# Altium project 2225B_VumetreFrequenciel.PrjPcb
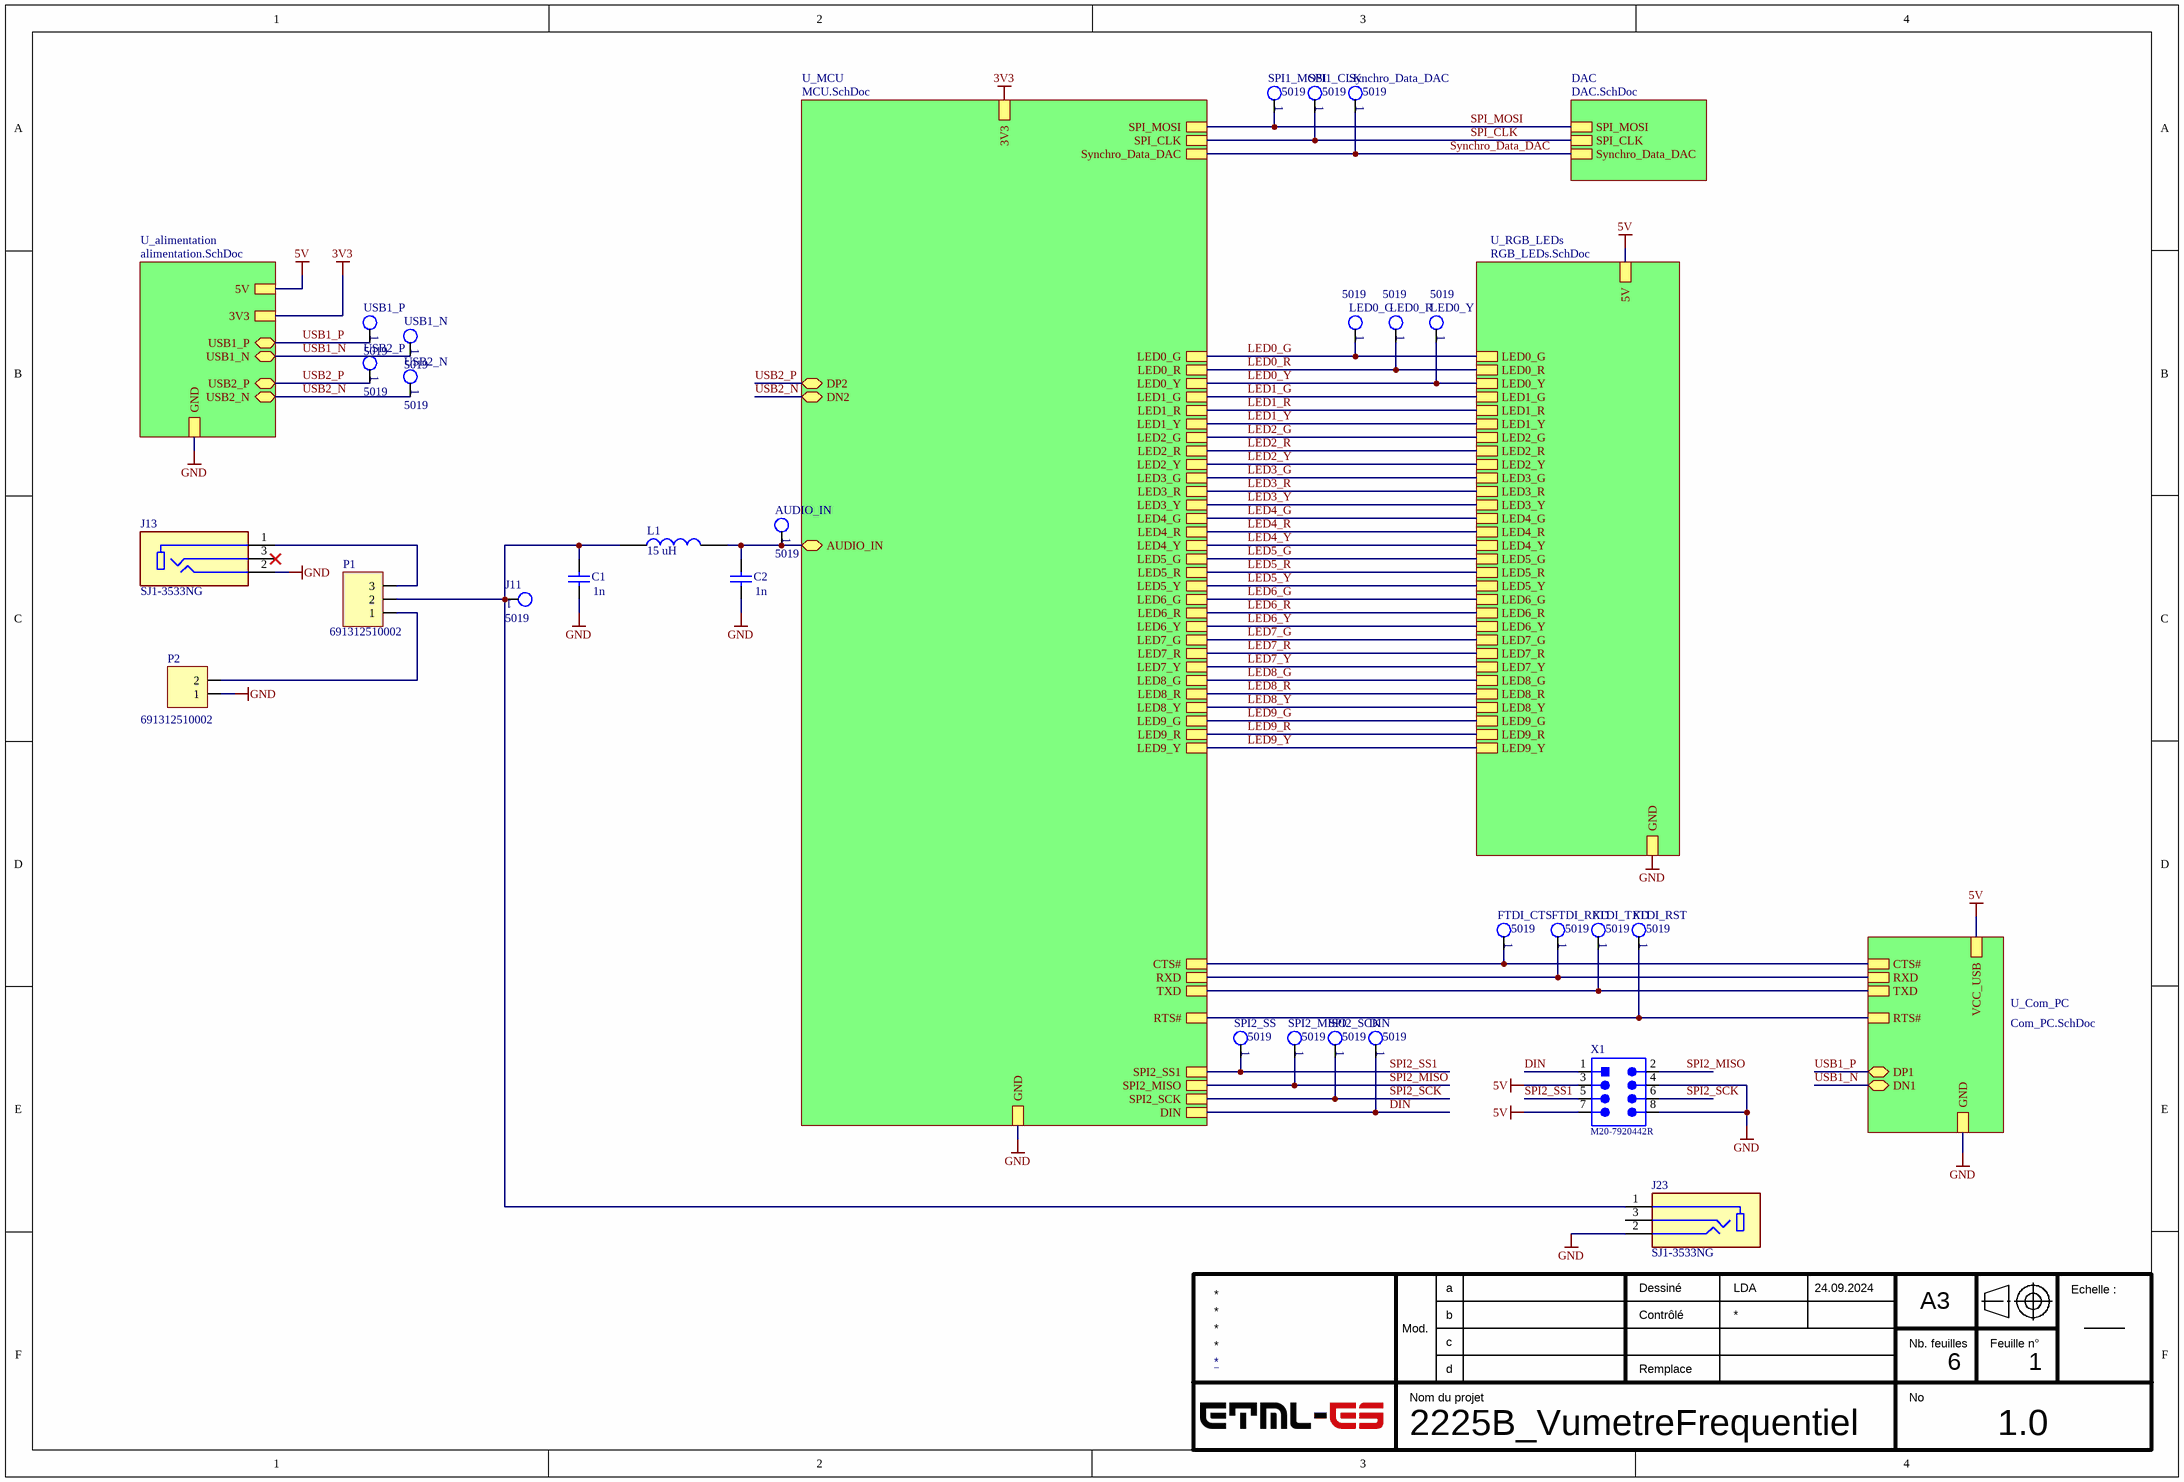
[diagram p0: 2225B_VumetreFrequenciel.SchDoc]
6 sheets, 145 parts. Net scope: hierarchical (ports join the sheet entries above them; power ports are global).
Board file: 2225B_VumetreFrequence_LDA.PcbDoc
Sheets:
  2225B_VumetreFrequenciel.SchDoc
    U_alimentation = alimentation.SchDoc
    U_Com_PC = Com_PC.SchDoc
    U_MCU = MCU.SchDoc
    U_RGB_LEDs = RGB_LEDs.SchDoc
    DAC = DAC.SchDoc

## Sheet 2225B_VumetreFrequenciel.SchDoc: 2225B_VumetreFrequentiel
size 408 x 276 mm; Date: 24.09.2024; DrawnBy: LDA; DocumentNumber: 1.0; SheetNumber: 1; SheetTotal: 6

### Parts
AUDIO_IN  5019  [KEYSTONE_5019]
C1  1n  [C0805]
C2  1n  [C0805]
DIN  5019  [KEYSTONE_5019]
FTDI_CTS  5019  [KEYSTONE_5019]
FTDI_RST  5019  [KEYSTONE_5019]
FTDI_RXD  5019  [KEYSTONE_5019]
FTDI_TXD  5019  [KEYSTONE_5019]
J11  5019  [KEYSTONE_5019]
J13  SJ1-3533NG  [CUI_SJ1-3533NG]
J23  SJ1-3533NG  [CUI_SJ1-3533NG]
L1  15 uH  [WE-PD_1210]
LED0_G  5019  [KEYSTONE_5019]
LED0_R  5019  [KEYSTONE_5019]
LED0_Y  5019  [KEYSTONE_5019]
P1  691312510002  [61300311121]
P2  691312510002  [LINX_CONBNC002]
SPI1_CLK  5019  [KEYSTONE_5019]
SPI1_MOSI  5019  [KEYSTONE_5019]
SPI2_MISO  5019  [KEYSTONE_5019]
SPI2_SCK  5019  [KEYSTONE_5019]
SPI2_SS  5019  [KEYSTONE_5019]
Synchro_Data_DAC  5019  [KEYSTONE_5019]
USB1_N  5019  [KEYSTONE_5019]
USB1_P  5019  [KEYSTONE_5019]
USB2_N  5019  [KEYSTONE_5019]
USB2_P  5019  [KEYSTONE_5019]
X1  M20-7920442R  [610108249121]

### Sub-sheets
DAC = DAC.SchDoc: SPI_MOSI, SPI_CLK, Synchro_Data_DAC
U_alimentation = alimentation.SchDoc: 5V, 3V3, GND, USB1_P (bidir), USB2_P (bidir), USB1_N (bidir), USB2_N (bidir)
U_Com_PC = Com_PC.SchDoc: CTS#, RXD, TXD, GND, RTS#, VCC_USB, DP1 (bidir), DN1 (bidir)
U_MCU = MCU.SchDoc: AUDIO_IN (bidir), 3V3, GND, Synchro_Data_DAC, SPI_CLK, SPI_MOSI, CTS#, RXD, TXD, RTS#, DP2 (bidir), DN2 (bidir), DIN, SPI2_SCK, SPI2_MISO, SPI2_SS1, LED0_G, LED0_R, LED0_Y, LED1_G, LED1_R, LED2_G, LED1_Y, LED2_R, LED2_Y, LED3_G, LED3_R, LED3_Y, LED4_G, LED4_R, LED4_Y, LED5_G, LED5_R, LED5_Y, LED6_G, LED6_R, LED6_Y, LED7_G, LED7_R, LED7_Y, LED8_G, LED8_R, LED8_Y, LED9_G, LED9_R, LED9_Y
U_RGB_LEDs = RGB_LEDs.SchDoc: 5V, GND, LED0_G, LED0_R, LED0_Y, LED1_G, LED1_R, LED1_Y, LED2_G, LED2_R, LED2_Y, LED3_G, LED3_R, LED3_Y, LED4_G, LED4_R, LED4_Y, LED5_G, LED5_R, LED5_Y, LED6_G, LED6_R, LED6_Y, LED7_G, LED7_R, LED7_Y, LED8_G, LED8_R, LED8_Y, LED9_G, LED9_R, LED9_Y

### Nets
3V3: sheet U_alimentation/3V3, sheet U_MCU/3V3
5V: X1.3 X1.7 ; sheet U_alimentation/5V, sheet U_Com_PC/VCC_USB, sheet U_RGB_LEDs/5V
GND: C1.2 C2.2 J13.2 J23.2 P2.1 X1.4 X1.8 ; sheet U_alimentation/GND, sheet U_Com_PC/GND, sheet U_MCU/GND, sheet U_RGB_LEDs/GND
DIN: DIN.1 X1.1 ; sheet U_MCU/DIN
LED0_G: LED0_G.1 ; sheet U_MCU/LED0_G, sheet U_RGB_LEDs/LED0_G
LED0_R: LED0_R.1 ; sheet U_MCU/LED0_R, sheet U_RGB_LEDs/LED0_R
LED0_Y: LED0_Y.1 ; sheet U_MCU/LED0_Y, sheet U_RGB_LEDs/LED0_Y
LED1_G: sheet U_MCU/LED1_G, sheet U_RGB_LEDs/LED1_G
LED1_R: sheet U_MCU/LED1_R, sheet U_RGB_LEDs/LED1_R
LED1_Y: sheet U_MCU/LED1_Y, sheet U_RGB_LEDs/LED1_Y
LED2_G: sheet U_MCU/LED2_G, sheet U_RGB_LEDs/LED2_G
LED2_R: sheet U_MCU/LED2_R, sheet U_RGB_LEDs/LED2_R
LED2_Y: sheet U_MCU/LED2_Y, sheet U_RGB_LEDs/LED2_Y
LED3_G: sheet U_MCU/LED3_G, sheet U_RGB_LEDs/LED3_G
LED3_R: sheet U_MCU/LED3_R, sheet U_RGB_LEDs/LED3_R
LED3_Y: sheet U_MCU/LED3_Y, sheet U_RGB_LEDs/LED3_Y
LED4_G: sheet U_MCU/LED4_G, sheet U_RGB_LEDs/LED4_G
LED4_R: sheet U_MCU/LED4_R, sheet U_RGB_LEDs/LED4_R
LED4_Y: sheet U_MCU/LED4_Y, sheet U_RGB_LEDs/LED4_Y
LED5_G: sheet U_MCU/LED5_G, sheet U_RGB_LEDs/LED5_G
LED5_R: sheet U_MCU/LED5_R, sheet U_RGB_LEDs/LED5_R
LED5_Y: sheet U_MCU/LED5_Y, sheet U_RGB_LEDs/LED5_Y
LED6_G: sheet U_MCU/LED6_G, sheet U_RGB_LEDs/LED6_G
LED6_R: sheet U_MCU/LED6_R, sheet U_RGB_LEDs/LED6_R
LED6_Y: sheet U_MCU/LED6_Y, sheet U_RGB_LEDs/LED6_Y
LED7_G: sheet U_MCU/LED7_G, sheet U_RGB_LEDs/LED7_G
LED7_R: sheet U_MCU/LED7_R, sheet U_RGB_LEDs/LED7_R
LED7_Y: sheet U_MCU/LED7_Y, sheet U_RGB_LEDs/LED7_Y
LED8_G: sheet U_MCU/LED8_G, sheet U_RGB_LEDs/LED8_G
LED8_R: sheet U_MCU/LED8_R, sheet U_RGB_LEDs/LED8_R
LED8_Y: sheet U_MCU/LED8_Y, sheet U_RGB_LEDs/LED8_Y
LED9_G: sheet U_MCU/LED9_G, sheet U_RGB_LEDs/LED9_G
LED9_R: sheet U_MCU/LED9_R, sheet U_RGB_LEDs/LED9_R
LED9_Y: sheet U_MCU/LED9_Y, sheet U_RGB_LEDs/LED9_Y
SPI2_MISO: SPI2_MISO.1 X1.2 ; sheet U_MCU/SPI2_MISO
SPI2_SCK: SPI2_SCK.1 X1.6 ; sheet U_MCU/SPI2_SCK
SPI2_SS1: SPI2_SS.1 X1.5 ; sheet U_MCU/SPI2_SS1
SPI_CLK: SPI1_CLK.1 ; sheet U_MCU/SPI_CLK, sheet DAC/SPI_CLK
SPI_MOSI: SPI1_MOSI.1 ; sheet U_MCU/SPI_MOSI, sheet DAC/SPI_MOSI
Synchro_Data_DAC: Synchro_Data_DAC.1 ; sheet U_MCU/Synchro_Data_DAC, sheet DAC/Synchro_Data_DAC
USB1_N: USB1_N.1 ; sheet U_alimentation/USB1_N, sheet U_Com_PC/DN1
USB1_P: USB1_P.1 ; sheet U_alimentation/USB1_P, sheet U_Com_PC/DP1
USB2_N: USB2_N.1 ; sheet U_alimentation/USB2_N, sheet U_MCU/DN2
USB2_P: USB2_P.1 ; sheet U_alimentation/USB2_P, sheet U_MCU/DP2
NetAUDIO_IN_1: AUDIO_IN.1 C2.1 L1.2 ; sheet U_MCU/AUDIO_IN
NetB1_1: FTDI_RXD.1 ; sheet U_Com_PC/RXD, sheet U_MCU/RXD
NetB1_3: FTDI_CTS.1 ; sheet U_Com_PC/CTS#, sheet U_MCU/CTS#
NetB1_5: FTDI_TXD.1 ; sheet U_Com_PC/TXD, sheet U_MCU/TXD
NetB1_11: FTDI_RST.1 ; sheet U_Com_PC/RTS#, sheet U_MCU/RTS#
NetC1_1: C1.1 J11.1 J23.1 L1.1 P1.2
NetJ13_1: J13.1 P1.3
NetP1_1: P1.1 P2.2

Not connected (* = marked no-connect by the designer): J13 3*; J23 3

### Notes on the sheet
- a
- Dessiné
- A3
- Echelle :
- Mod.
- b
- c
- d
- Contrôlé
- Remplace
- Nb. feuilles
- Feuille n°
- Nom du projet
- No

### Library data of the parts
AUDIO_IN DIN FTDI_CTS FTDI_RST FTDI_RXD FTDI_TXD J11 SPI1_CLK SPI1_MOSI SPI2_MISO SPI2_SCK SPI2_SS Synchro_Data_DAC USB1_N USB1_P USB2_N USB2_P = CMP-1672-00008-2: NexarPartId: 22052288; Manufacturer: Keystone Electronics; Number of Contacts: 1; Contact Material: Bronze, Silver; Number of Pins: 1; Lead Free: Lead Free; Packaging: Tape and Reel; Mount: Surface Mount; Height: 2.286mm; Contact Plating: Silver; Material: Bronze; Termination: SMD/SMT; REACH SVHC: No SVHC; RoHS: Compliant; Manufacturer Part Number: 5019
C1 C2 = Cap: Capacitor; Published: 8-Jun-2000; LatestRevisionDate: 17-Jul-2002; LatestRevisionNote: Re-released for DXP Platform.; PackageReference: RAD-0.3; Publisher: Altium Limited; PackageDescription: Radial Cap, Thru-Hole; 2 Leads; 0.3 in Pin Spacing; Value: 1n
J13 J23 = SJ1-3533NG: 3.5 mm Right-Angle Stereo Jack, 3 Pin PCB Mount, Isolated Ground; MF: {'manufacturer': u'CUI'}; Price: None; Availability: Unavailable; Package: None; MP: SJ1-3533NG; Value: *
L1 = CDRH125NP-220MC: Fixed Inductors 22uH 2.80A 0.028ohms; Manufacturer_Name: Sumida; Geometry.Height: 6mm; Future Part Number: *; Future Price/Stock: *; Manufacturer_Part_Number: CDRH125NP-220MC; Datasheet Link: http://products.sumida.com/products/pdf/CDRH125,CDRH125LD.pdf
LED0_G LED0_R LED0_Y = CMP-1672-00008-2: NexarPartId: 22052288; Manufacturer: Keystone Electronics; Number of Contacts: 1; Material: Bronze; Contact Material: Bronze, Silver; Number of Pins: 1; Lead Free: Lead Free; Packaging: Tape and Reel; Mount: Surface Mount; Height: 2.286mm; Contact Plating: Silver; Termination: SMD/SMT; REACH SVHC: No SVHC; RoHS: Compliant; Manufacturer Part Number: 5019
P1 = MHDR1X3: Header, 3-Pin; LatestRevisionDate: 17-Jul-2002; LatestRevisionNote: Re-released for DXP Platform.; Publisher: Altium Limited
P2 = MHDR1X2: Header, 2-Pin; LatestRevisionDate: 17-Jul-2002; LatestRevisionNote: Re-released for DXP Platform.; Publisher: Altium Limited
X1 = 610108249121: WR-PHD Pin Header, THT, pitch 2.54mm, Dual Row, Angled, 8p; Manufacturer Part Number: 61300821021; Manufacturer: Wurth Elektronik; Pin Number: 8; Rated Current: 3A; Working Voltage: 250VAC; Withstanding Voltage: 500VAC; Contact Resistance: 20mOhm; ComponentLink1Description: Manufacturer; ComponentLink1URL: http://www.we-online.de; ComponentLink2Description: Datasheet; ComponentLink2URL: https://www.we-online.com/catalog/datasheet/61300821021.pdf; Pitch: 2.54mm; Operating Temperature: -40 to +105degC; Mounting Technology: THT; Packaging: Bag; Gender: Pin Header; Row Number: Dual; Orientation: Angled

## Sheet alimentation.SchDoc: 2225B_VumetreFrequentiel
size 276 x 198 mm; Date: 24.09.2024; DrawnBy: LDA; DocumentNumber: 1.0; SheetNumber: 2; SheetTotal: 6
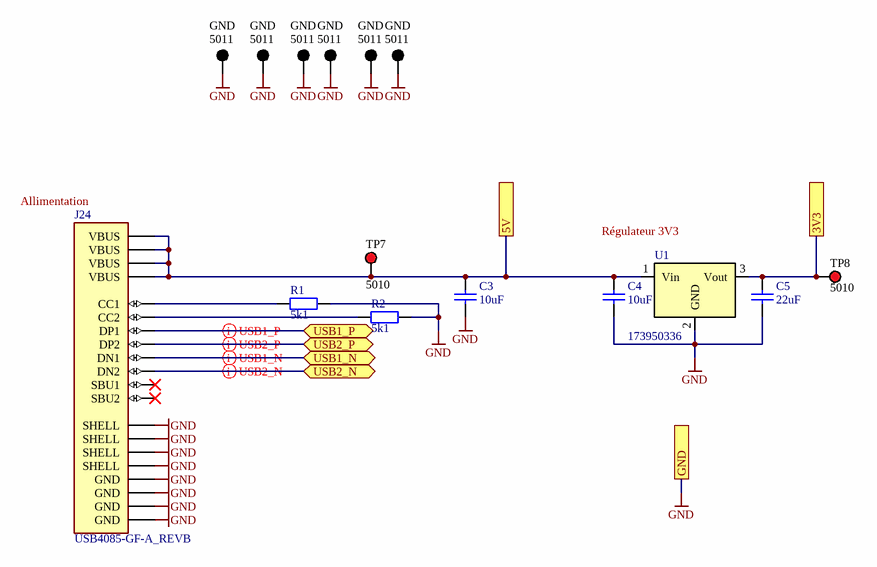
[diagram p1: alimentation.SchDoc]

### Parts
(Parts that share a designator on the sheet are numbered #1, #2 ... from top to bottom, then left to right.)
C3  10uF  [C0805]
C4  10uF  [C0805]
C5  22uF  [C0805]
GND#1  5011  [KSTN-5011_V]
GND#2  5011  [KSTN-5011_V]
GND#3  5011  [KSTN-5011_V]
GND#4  5011  [KSTN-5011_V]
GND#5  5011  [KSTN-5011_V]
GND#6  5011  [KSTN-5011_V]
J24  USB4085-GF-A_REVB  [GCT_USB4085-GF-A_REVB]
R1  5k1  [RESC2012X06M]
R2  5k1  [RESC2012X06M]
TP7  5010  [KSTN-5010_V]
TP8  5010  [KSTN-5010_V]
U1  173950336  [WPME-FDSM_SIP-3_L11.6W8H10.4]

### Ports
3V3, 5V, GND, USB1_N (bidir), USB1_P (bidir), USB2_N (bidir), USB2_P (bidir)

### Nets
3V3: C5.2 TP8.1 U1.3(Vout) ; port 3V3
5V: C3.2 C4.2 J24.A4(VBUS) J24.A9(VBUS) J24.B4(VBUS) J24.B9(VBUS) TP7.1 U1.1(Vin) ; port 5V
GND: C3.1 C4.1 C5.1 GND#1.1 GND#2.1 GND#3.1 GND#4.1 GND#5.1 GND#6.1 J24.A1(GND) J24.A12(GND) J24.B1(GND) J24.B12(GND) J24.S1(SHELL) J24.S2(SHELL) J24.S3(SHELL) J24.S4(SHELL) R1.1 R2.1 U1.2(GND) ; port GND
USB1_N: J24.A7(DN1) ; port USB1_N
USB1_P: J24.A6(DP1) ; port USB1_P
USB2_N: J24.B7(DN2) ; port USB2_N
USB2_P: J24.B6(DP2) ; port USB2_P
NetJ24_A5: J24.A5(CC1) R1.2
NetJ24_B5: J24.B5(CC2) R2.2

Not connected (* = marked no-connect by the designer): J24 A8(SBU1)* B8(SBU2)*

### Layout directives
differential pair: USB1_N, USB1_P, USB2_N, USB2_P

### Notes on the sheet
- (near J24) Allimentation
- Régulateur 3V3
- a
- Dessiné
- A4
- Echelle :
- Mod.
- b
- c
- d
- Contrôlé
- Remplace
- Nb. feuilles
- Feuille n°
- Nom du projet
- No

### Library data of the parts
C3-C5 = Cap: Capacitor; Published: 8-Jun-2000; LatestRevisionDate: 17-Jul-2002; LatestRevisionNote: Re-released for DXP Platform.; PackageReference: RAD-0.3; Publisher: Altium Limited; PackageDescription: Radial Cap, Thru-Hole; 2 Leads; 0.3 in Pin Spacing
  C3 C4: Value: 10uF
  C5: Value: 22uF
GND#1-GND#6 = CMP-1672-00003-4: Test Point, Black, Through Hole, RoHS, Bulk; Manufacturer: Keystone; ComponentLink2URL: http://www.keyelco.com/product-pdf.cfm?p=1320; Colour: Black; Pins: 1; REACH SVHC: No SVHC; ComponentLink1URL: http://www.keyelco.com/; PackageReference: 5011; Contact Plating: Silver; Package Quantity: 100; Packaging: Bulk; RoHSCompliant: true; Height: 8.12 mm; PackageDescription: 1-Pin Through Hole Device, Dia 3.17 mm; Mount: Through Hole; Mounting Technology: Through Hole; DatasheetVersion: Rev. F, 12/2013; ComponentLink1Description: Manufacturer URL; Contact Material: Bronze; ComponentLink2Description: Datasheet
J24 = USB4085-GF-A_REVB: USB-C (USB TYPE-C) USB 2.0 æ’åº§è¿žæŽ¥å™¨ 24 (16+8 Dummy) ä½é€šå­”ã€ç›´è§’ã€ä½Žæˆæœ¬ã€3.46mm å¤–å½¢ã€16 é’ˆã€æ°´å¹³ã€é¡¶éƒ¨å®‰è£…; MF: Global Connector Technology; SnapEDA_Link: https://www.snapeda.com/parts/USB4085-GF-A/Global+Connector+Technology/view-part/?ref=snap; Package: None; Value: *; MP: USB4085-GF-A; Check_prices: https://www.snapeda.com/parts/USB4085-GF-A/Global+Connector+Technology/view-part/?ref=eda
R1 R2 = Res2: Resistor; Published: 8-Jun-2000; LatestRevisionDate: 17-Jul-2002; LatestRevisionNote: Re-released for DXP Platform.; PackageReference: AXIAL-0.4; Publisher: Altium Limited; PackageDescription: Axial Device, Thru-Hole; 2 Leads; 0.4 in Pin Spacing; Value: 5k1
TP7 TP8 = CMP-1672-00002-4: Test Point, Red, Through Hole, RoHS, Bulk; Manufacturer: Keystone; Contact Material: Bronze; Mounting Technology: Through Hole; RoHSCompliant: true; Pins: 1; Package Quantity: 100; ComponentLink2Description: Datasheet; Height: 8.12 mm; ComponentLink1URL: http://www.keyelco.com/; DatasheetVersion: Rev. F, 12/2013; Mount: Through Hole; PackageReference: 5010; Contact Plating: Silver; Packaging: Bulk; Colour: Red; REACH SVHC: No SVHC; PackageDescription: 1-Pin Through Hole Device, Dia 3.17 mm; ComponentLink2URL: http://www.keyelco.com/product-pdf.cfm?p=1319; ComponentLink1Description: Manufacturer URL
U1 = 173950536

## Sheet Com_PC.SchDoc: 2225B_VumetreFrequentiel
size 276 x 198 mm; Date: 24.09.2024; DrawnBy: LDA; DocumentNumber: 1.0; SheetNumber: 3; SheetTotal: 6
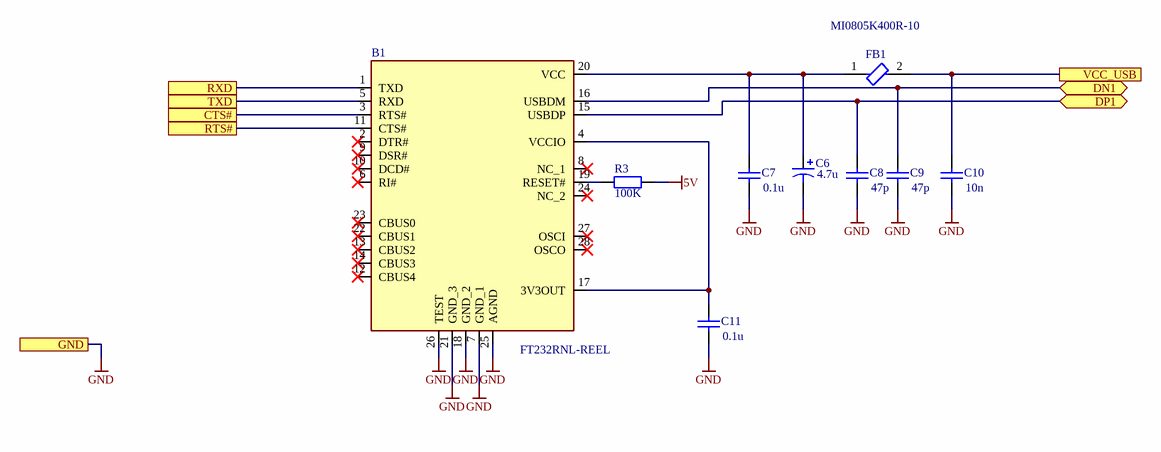
[diagram p2: Com_PC.SchDoc]

### Parts
B1  FT232RNL-REEL  [SOP65P780X200-28N]
C6  4.7u  [PCAP_SVP_A5_PAN-M]
C7  0.1u  [C0805]
C8  47p  [C0805]
C9  47p  [C0805]
C10  10n  [C0805]
C11  0.1u  [C0805]
FB1  MI0805K400R-10  [FP-MI0805-MFG]
R3  100K  [RESC2012X06M]

### Ports
CTS#, DN1 (bidir), DP1 (bidir), GND, RTS#, RXD, TXD, VCC_USB

### Nets
5V: C10.1 FB1.2 R3.1 ; port VCC_USB
GND: B1.7(GND_1) B1.18(GND_2) B1.21(GND_3) B1.25(AGND) B1.26(TEST) C6.2 C7.2 C8.2 C9.2 C10.2 C11.2 ; port GND
USB1_N: B1.16(USBDM) C9.1 ; port DN1
USB1_P: B1.15(USBDP) C8.1 ; port DP1
NetB1_1: B1.1(TXD) ; port RXD
NetB1_3: B1.3(RTS#) ; port CTS#
NetB1_4: B1.4(VCCIO) B1.17(3V3OUT) C11.1
NetB1_5: B1.5(RXD) ; port TXD
NetB1_11: B1.11(CTS#) ; port RTS#
NetB1_19: B1.19(RESET#) R3.2
NetB1_20: B1.20(VCC) C6.1 C7.1 FB1.1

Not connected (* = marked no-connect by the designer): B1 2(DTR#)* 6(RI#)* 8(NC_1)* 9(DSR#)* 10(DCD#)* 12(CBUS4)* 13(CBUS2)* 14(CBUS3)* 22(CBUS1)* 23(CBUS0)* 24(NC_2)* 27(OSCI)* 28(OSCO)*

### Notes on the sheet
- a
- Dessiné
- A4
- Echelle :
- Mod.
- b
- c
- d
- Contrôlé
- Remplace
- Nb. feuilles
- Feuille n°
- Nom du projet
- No

### Library data of the parts
B1 = FT232RNL-REEL: UART Interface IC USB Full Speed to Serial UART IC, Includes Oscillator and EEPROM, SSOP-28; Manufacturer_Name: FTDI Chip; Geometry.Height: 2mm; Manufacturer_Part_Number: FT232RNL-REEL; Mouser Part Number: 895-FT232RNL-REEL; Mouser Price/Stock: https://www.mouser.co.uk/ProductDetail/FTDI/FT232RNL-REEL?qs=By6Nw2ByBD3LSfXryh9qRQ%3D%3D; Arrow Part Number: FT232RNL-REEL; Arrow Price/Stock: https://www.arrow.com/en/products/ft232rnl-reel/ftdi-chip?utm_currency=USD&region=europe; Datasheet Link: https://ftdichip.com/wp-content/uploads/2022/12/DS_FT232RN.pdf
C6 = Cap Pol1: Polarized Capacitor (Radial); Published: 8-Jun-2000; LatestRevisionDate: 17-Jul-2002; LatestRevisionNote: Re-released for DXP Platform.; PackageReference: RB7.6-15; Publisher: Altium Limited; PackageDescription: Polarized Capacitor (Radial); 2 Leads; Value: 4.7u
C7-C11 = Cap: Capacitor; Published: 8-Jun-2000; LatestRevisionDate: 17-Jul-2002; LatestRevisionNote: Re-released for DXP Platform.; PackageReference: RAD-0.3; Publisher: Altium Limited; PackageDescription: Radial Cap, Thru-Hole; 2 Leads; 0.3 in Pin Spacing
  C7 C11: Value: 0.1u
  C8 C9: Value: 47p
  C10: Value: 10n
FB1 = CMP-2000-06702-2: FERRITE BEAD 40 OHM 0805 1LN; Impedance: 40R; Max Current Rating: 1.5A; Tolerance: 25%; Test Frequency: 100MHz; DC Resistance (DCR): 50mR; Number of Lines: 1; Min Operating Temperature: -40°C; Case/Package: 0805; Depth: 1.45mm; Current Rating: 1.5A; Width: 0.049inch; Core Material: Ferrite; Termination: SMD/SMT; Case Code (Imperial): 0805; Packaging: Tape and Reel; Weight: 0.00392oz; Lead Free: Lead Free; Length: 2mm; Max Operating Temperature: 125°C; Mount: Surface Mount; Case Code (Metric): 2012; Frequency: 100MHz; Height: 0.043inch; Package Quantity: 1; Material: Ferrite; Contact Plating: Tin; Max DC Current: 1.5A
R3 = Res2: Resistor; Published: 8-Jun-2000; LatestRevisionDate: 17-Jul-2002; LatestRevisionNote: Re-released for DXP Platform.; PackageReference: AXIAL-0.4; Publisher: Altium Limited; PackageDescription: Axial Device, Thru-Hole; 2 Leads; 0.4 in Pin Spacing; Value: 100K

## Sheet MCU.SchDoc: 2225B_VumetreFrequentiel
size 408 x 276 mm; Date: 24.09.2024; DrawnBy: LDA; DocumentNumber: 1.0; Revision: 1.0; SheetNumber: 5; SheetTotal: 6
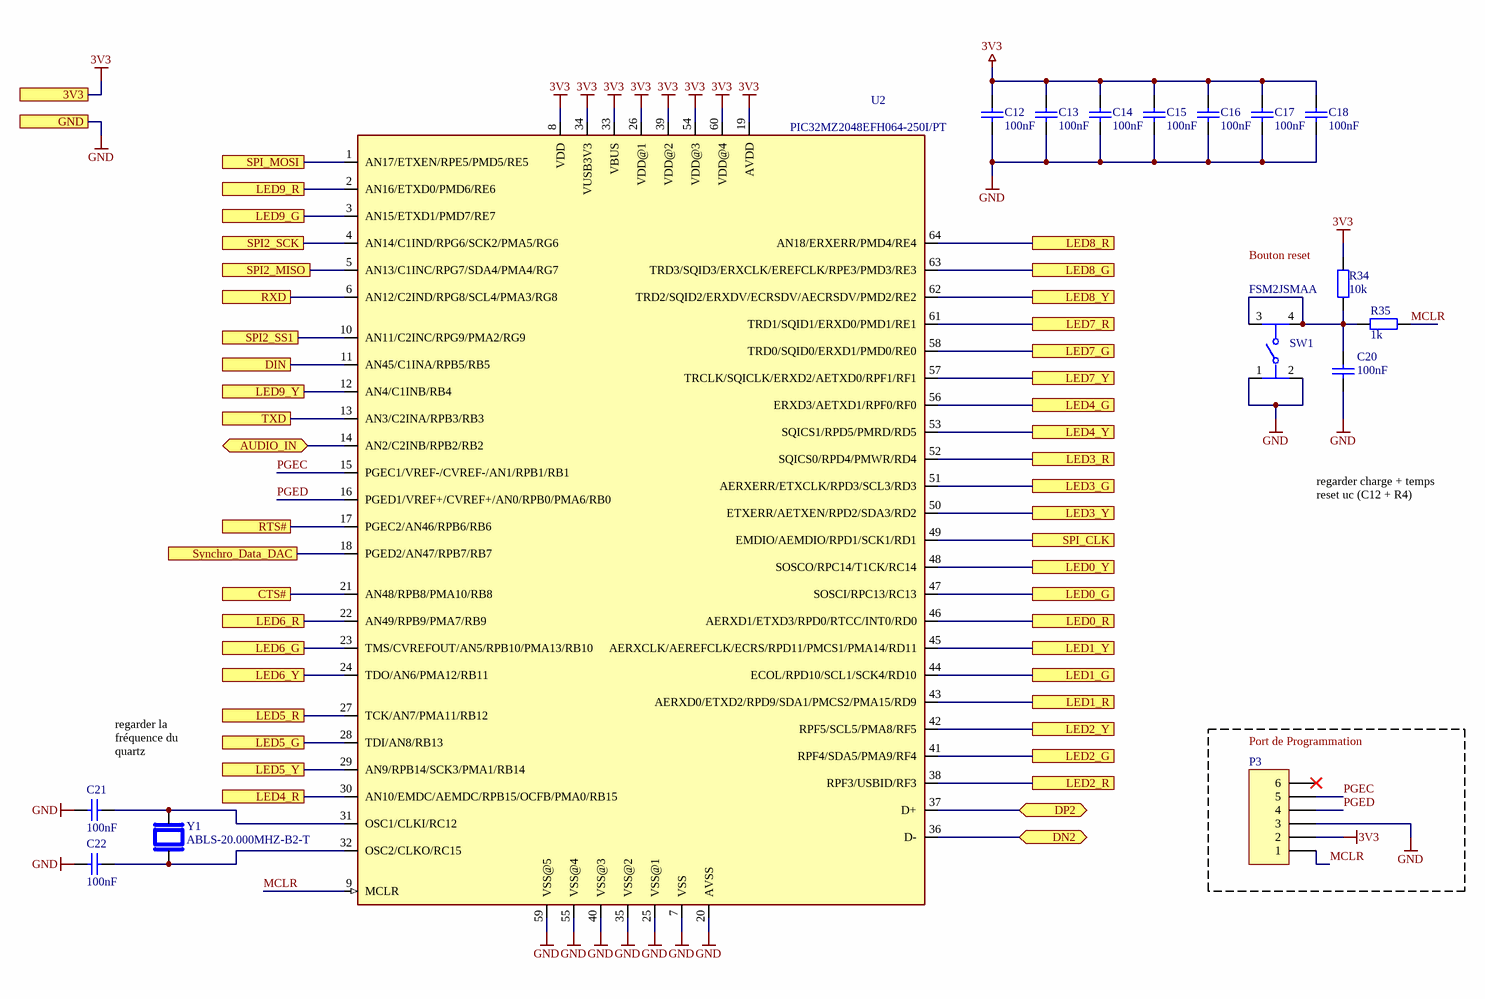
[diagram p3: MCU.SchDoc]

### Parts
C12  100nF  [C0805]
C13  100nF  [C0805]
C14  100nF  [C0805]
C15  100nF  [C0805]
C16  100nF  [C0805]
C17  100nF  [C0805]
C18  100nF  [C0805]
C20  100nF  [C0805]
C21  100nF  [C0805]
C22  100nF  [C0805]
P3  76384-406LF  [HDR1X6]  (value not drawn)
R34  10k  [RESC2012X06M]
R35  1k  [RESC2012X06M]
SW1  FSM2JSMAA  [FP-FSM2JSMAA-MFG]
U2  PIC32MZ2048EFH064-250I/PT  [QFP50P1200X1200X120-64N]
Y1  ABLS-20.000MHZ-B2-T  [XTAL_ABLS-20.000MHZ-B2-T]

### Blocks framed on the sheet
Port de Programmation: P3

### Ports
3V3, AUDIO_IN (bidir), CTS#, DIN, DN2 (bidir), DP2 (bidir), GND, LED0_G, LED0_R, LED0_Y, LED1_G, LED1_R, LED1_Y, LED2_G, LED2_R, LED2_Y, LED3_G, LED3_R, LED3_Y, LED4_G, LED4_R, LED4_Y, LED5_G, LED5_R, LED5_Y, LED6_G, LED6_R, LED6_Y, LED7_G, LED7_R, LED7_Y, LED8_G, LED8_R, LED8_Y, LED9_G, LED9_R, LED9_Y, RTS#, RXD, SPI2_MISO, SPI2_SCK, SPI2_SS1, SPI_CLK, SPI_MOSI, Synchro_Data_DAC, TXD

### Nets
3V3: C12.1 C13.1 C14.1 C15.1 C16.1 C17.1 C18.1 P3.2 R34.1 U2.8(VDD) U2.19(AVDD) U2.26(VDD@1) U2.33(VBUS) U2.34(VUSB3V3) U2.39(VDD@2) U2.54(VDD@3) U2.60(VDD@4) ; port 3V3
GND: C12.2 C13.2 C14.2 C15.2 C16.2 C17.2 C18.2 C20.1 C21.2 C22.2 P3.3 SW1.1 SW1.2 U2.7(VSS) U2.20(AVSS) U2.25(VSS@1) U2.35(VSS@2) U2.40(VSS@3) U2.55(VSS@4) U2.59(VSS@5) ; port GND
DIN: U2.11(AN45/C1INA/RPB5/RB5) ; port DIN
LED0_G: U2.47(SOSCI/RPC13/RC13) ; port LED0_G
LED0_R: U2.46(AERXD1/ETXD3/RPD0/RTCC/INT0/RD0) ; port LED0_R
LED0_Y: U2.48(SOSCO/RPC14/T1CK/RC14) ; port LED0_Y
LED1_G: U2.44(ECOL/RPD10/SCL1/SCK4/RD10) ; port LED1_G
LED1_R: U2.43(AERXD0/ETXD2/RPD9/SDA1/PMCS2/PMA15/RD9) ; port LED1_R
LED1_Y: U2.45(AERXCLK/AEREFCLK/ECRS/RPD11/PMCS1/PMA14/RD11) ; port LED1_Y
LED2_G: U2.41(RPF4/SDA5/PMA9/RF4) ; port LED2_G
LED2_R: U2.38(RPF3/USBID/RF3) ; port LED2_R
LED2_Y: U2.42(RPF5/SCL5/PMA8/RF5) ; port LED2_Y
LED3_G: U2.51(AERXERR/ETXCLK/RPD3/SCL3/RD3) ; port LED3_G
LED3_R: U2.52(SQICS0/RPD4/PMWR/RD4) ; port LED3_R
LED3_Y: U2.50(ETXERR/AETXEN/RPD2/SDA3/RD2) ; port LED3_Y
LED4_G: U2.56(ERXD3/AETXD1/RPF0/RF0) ; port LED4_G
LED4_R: U2.30(AN10/EMDC/AEMDC/RPB15/OCFB/PMA0/RB15) ; port LED4_R
LED4_Y: U2.53(SQICS1/RPD5/PMRD/RD5) ; port LED4_Y
LED5_G: U2.28(TDI/AN8/RB13) ; port LED5_G
LED5_R: U2.27(TCK/AN7/PMA11/RB12) ; port LED5_R
LED5_Y: U2.29(AN9/RPB14/SCK3/PMA1/RB14) ; port LED5_Y
LED6_G: U2.23(TMS/CVREFOUT/AN5/RPB10/PMA13/RB10) ; port LED6_G
LED6_R: U2.22(AN49/RPB9/PMA7/RB9) ; port LED6_R
LED6_Y: U2.24(TDO/AN6/PMA12/RB11) ; port LED6_Y
LED7_G: U2.58(TRD0/SQID0/ERXD1/PMD0/RE0) ; port LED7_G
LED7_R: U2.61(TRD1/SQID1/ERXD0/PMD1/RE1) ; port LED7_R
LED7_Y: U2.57(TRCLK/SQICLK/ERXD2/AETXD0/RPF1/RF1) ; port LED7_Y
LED8_G: U2.63(TRD3/SQID3/ERXCLK/EREFCLK/RPE3/PMD3/RE3) ; port LED8_G
LED8_R: U2.64(AN18/ERXERR/PMD4/RE4) ; port LED8_R
LED8_Y: U2.62(TRD2/SQID2/ERXDV/ECRSDV/AECRSDV/PMD2/RE2) ; port LED8_Y
LED9_G: U2.3(AN15/ETXD1/PMD7/RE7) ; port LED9_G
LED9_R: U2.2(AN16/ETXD0/PMD6/RE6) ; port LED9_R
LED9_Y: U2.12(AN4/C1INB/RB4) ; port LED9_Y
MCLR: P3.1 R35.1 U2.9(MCLR)
PGEC: P3.5 U2.15(PGEC1/VREF-/CVREF-/AN1/RPB1/RB1)
PGED: P3.4 U2.16(PGED1/VREF+/CVREF+/AN0/RPB0/PMA6/RB0)
SPI2_MISO: U2.5(AN13/C1INC/RPG7/SDA4/PMA4/RG7) ; port SPI2_MISO
SPI2_SCK: U2.4(AN14/C1IND/RPG6/SCK2/PMA5/RG6) ; port SPI2_SCK
SPI2_SS1: U2.10(AN11/C2INC/RPG9/PMA2/RG9) ; port SPI2_SS1
SPI_CLK: U2.49(EMDIO/AEMDIO/RPD1/SCK1/RD1) ; port SPI_CLK
SPI_MOSI: U2.1(AN17/ETXEN/RPE5/PMD5/RE5) ; port SPI_MOSI
Synchro_Data_DAC: U2.18(PGED2/AN47/RPB7/RB7) ; port Synchro_Data_DAC
USB2_N: U2.36(D-) ; port DN2
USB2_P: U2.37(D+) ; port DP2
NetAUDIO_IN_1: U2.14(AN2/C2INB/RPB2/RB2) ; port AUDIO_IN
NetB1_1: U2.6(AN12/C2IND/RPG8/SCL4/PMA3/RG8) ; port RXD
NetB1_3: U2.21(AN48/RPB8/PMA10/RB8) ; port CTS#
NetB1_5: U2.13(AN3/C2INA/RPB3/RB3) ; port TXD
NetB1_11: U2.17(PGEC2/AN46/RPB6/RB6) ; port RTS#
NetC20_2: C20.2 R34.2 R35.2 SW1.3 SW1.4
NetC21_1: C21.1 U2.31(OSC1/CLKI/RC12) Y1.2
NetC22_1: C22.1 U2.32(OSC2/CLKO/RC15) Y1.1

Not connected (* = marked no-connect by the designer): P3 6*

### Notes on the sheet
- (near R34) Bouton reset
- regarder charge + temps reset uc (C12 + R4)
- regarder la fréquence du quartz
- a
- Dessiné
- A3
- Echelle :
- Mod.
- b
- c
- d
- Contrôlé
- Remplace
- Nb. feuilles
- Feuille n°
- Nom du projet
- No

### Library data of the parts
C12-C18 = Cap: Capacitor; Published: 8-Jun-2000; LatestRevisionDate: 17-Jul-2002; LatestRevisionNote: Re-released for DXP Platform.; PackageReference: RAD-0.3; Publisher: Altium Limited; PackageDescription: Radial Cap, Thru-Hole; 2 Leads; 0.3 in Pin Spacing; Value: 100nF
C20-C22 = Cap: 10nf; Published: 8-Jun-2000; LatestRevisionDate: 17-Jul-2002; LatestRevisionNote: Re-released for DXP Platform.; PackageReference: RAD-0.3; Publisher: Altium Limited; PackageDescription: Radial Cap, Thru-Hole; 2 Leads; 0.3 in Pin Spacing; Value: 100nF
P3 = Header 6: Header, 6-Pin; LatestRevisionDate: 17-Jul-2002; LatestRevisionNote: Re-released for DXP Platform.; Publisher: Altium Limited
R34 R35 = Res2: Resistor; Published: 8-Jun-2000; LatestRevisionDate: 17-Jul-2002; LatestRevisionNote: Re-released for DXP Platform.; PackageReference: AXIAL-0.4; Publisher: Altium Limited; PackageDescription: Axial Device, Thru-Hole; 2 Leads; 0.4 in Pin Spacing
  R34: Value: 10k
  R35: Value: 1k
SW1 = CMP-03402-000003-1: SWITCH TACTILE SPST-NO 0.05A 24V; Manufacturer: TE Connectivity; Standoff Height: 0.05mm; Contact Current Rating: 50mA; Electromechanical Life: 100000Cycles; Operating Force: 260gf; Contact Resistance: 100mΩ; Package: 0; Temperature Range High: +85°C; Temperature: -35°C to +85°C; Category: Switch; Manufacturer Part Number: FSM2JSMAA; RoHS: TRUE; Mouser Description: Tactile Switches TACTILE 260G FORCE S; Device Class L1: Electromechanical; Mount: Surface Mount; Height: 4.59mm; ComponentLink2URL: https://www.te.com/commerce/DocumentDelivery/DDEController?Action=showdoc&DocId=Customer+Drawing%7F2-1437565-7%7FV%7Fpdf%7FEnglish%7FENG_CD_2-1437565-7_V.pdf%7F2-1437565-8; Temperature Range Low: -35°C; Voltage Rating Dc: 24V; Lead Free: Yes; Automotive: No; Throw Configuration: SPST-NO; Octopart: https://octopart.com/fsm2jsmaa-te+connectivity-41720620; Device Class L2: Switches; Device Class L3: Pushbutton Switches; ComponentLink2Description: Datasheet; Digikey Description: SWITCH TACTILE SPST-NO 0.05A 24V
U2 = PIC32MZ2048EFH064-250I/PT: MIPS32Â® M-Class PICÂ® 32MZ Microcontroller IC 32-Bit 250MHz 2MB _2M x 8_ FLASH 64-TQFP _10x10_; MF: Microchip; MP: PIC32MZ2048EFH064-250I/PT; SnapEDA_Link: https://www.snapeda.com/parts/PIC32MZ2048EFH064-250I/PT/Microchip/view-part/1145914/?ref=snap; Digi-Key_Purchase_URL: https://www.digikey.com/product-detail/en/microchip-technology/PIC32MZ2048EFH064-250I-PT/PIC32MZ2048EFH064-250I-PT-ND/6152256?utm_source=snapeda&utm_medium=aggregator&utm_campaign=symbol; Value: *; Package: TQFP-64 Microchip; Digi-Key_Part_Number: PIC32MZ2048EFH064-250I/PT-ND
Y1 = ABLS-20.000MHZ-B2-T: HC/49US (AT49) SMD LOW PROFILE CRYSTAL; MF: Abracon LLC; Availability: In Stock; SnapEDA_Link: https://www.snapeda.com/parts/ABLS-20.000MHZ-B2-T/Abracon+LLC/view-part/?ref=snap; Check_prices: https://www.snapeda.com/parts/ABLS-20.000MHZ-B2-T/Abracon+LLC/view-part/?ref=eda; Price: None; Package: HC-49/US Abracon LLC; Purchase-URL: https://pricing.snapeda.com/search/part/ABLS-20.000MHZ-B2-T/?ref=eda; MP: ABLS-20.000MHZ-B2-T; Value: *

## Sheet RGB_LEDs.SchDoc: 2225B_VumetreFrequentiel
size 408 x 276 mm; Date: 24.09.2024; DrawnBy: LDA; DocumentNumber: 1.0; SheetNumber: 4; SheetTotal: 6
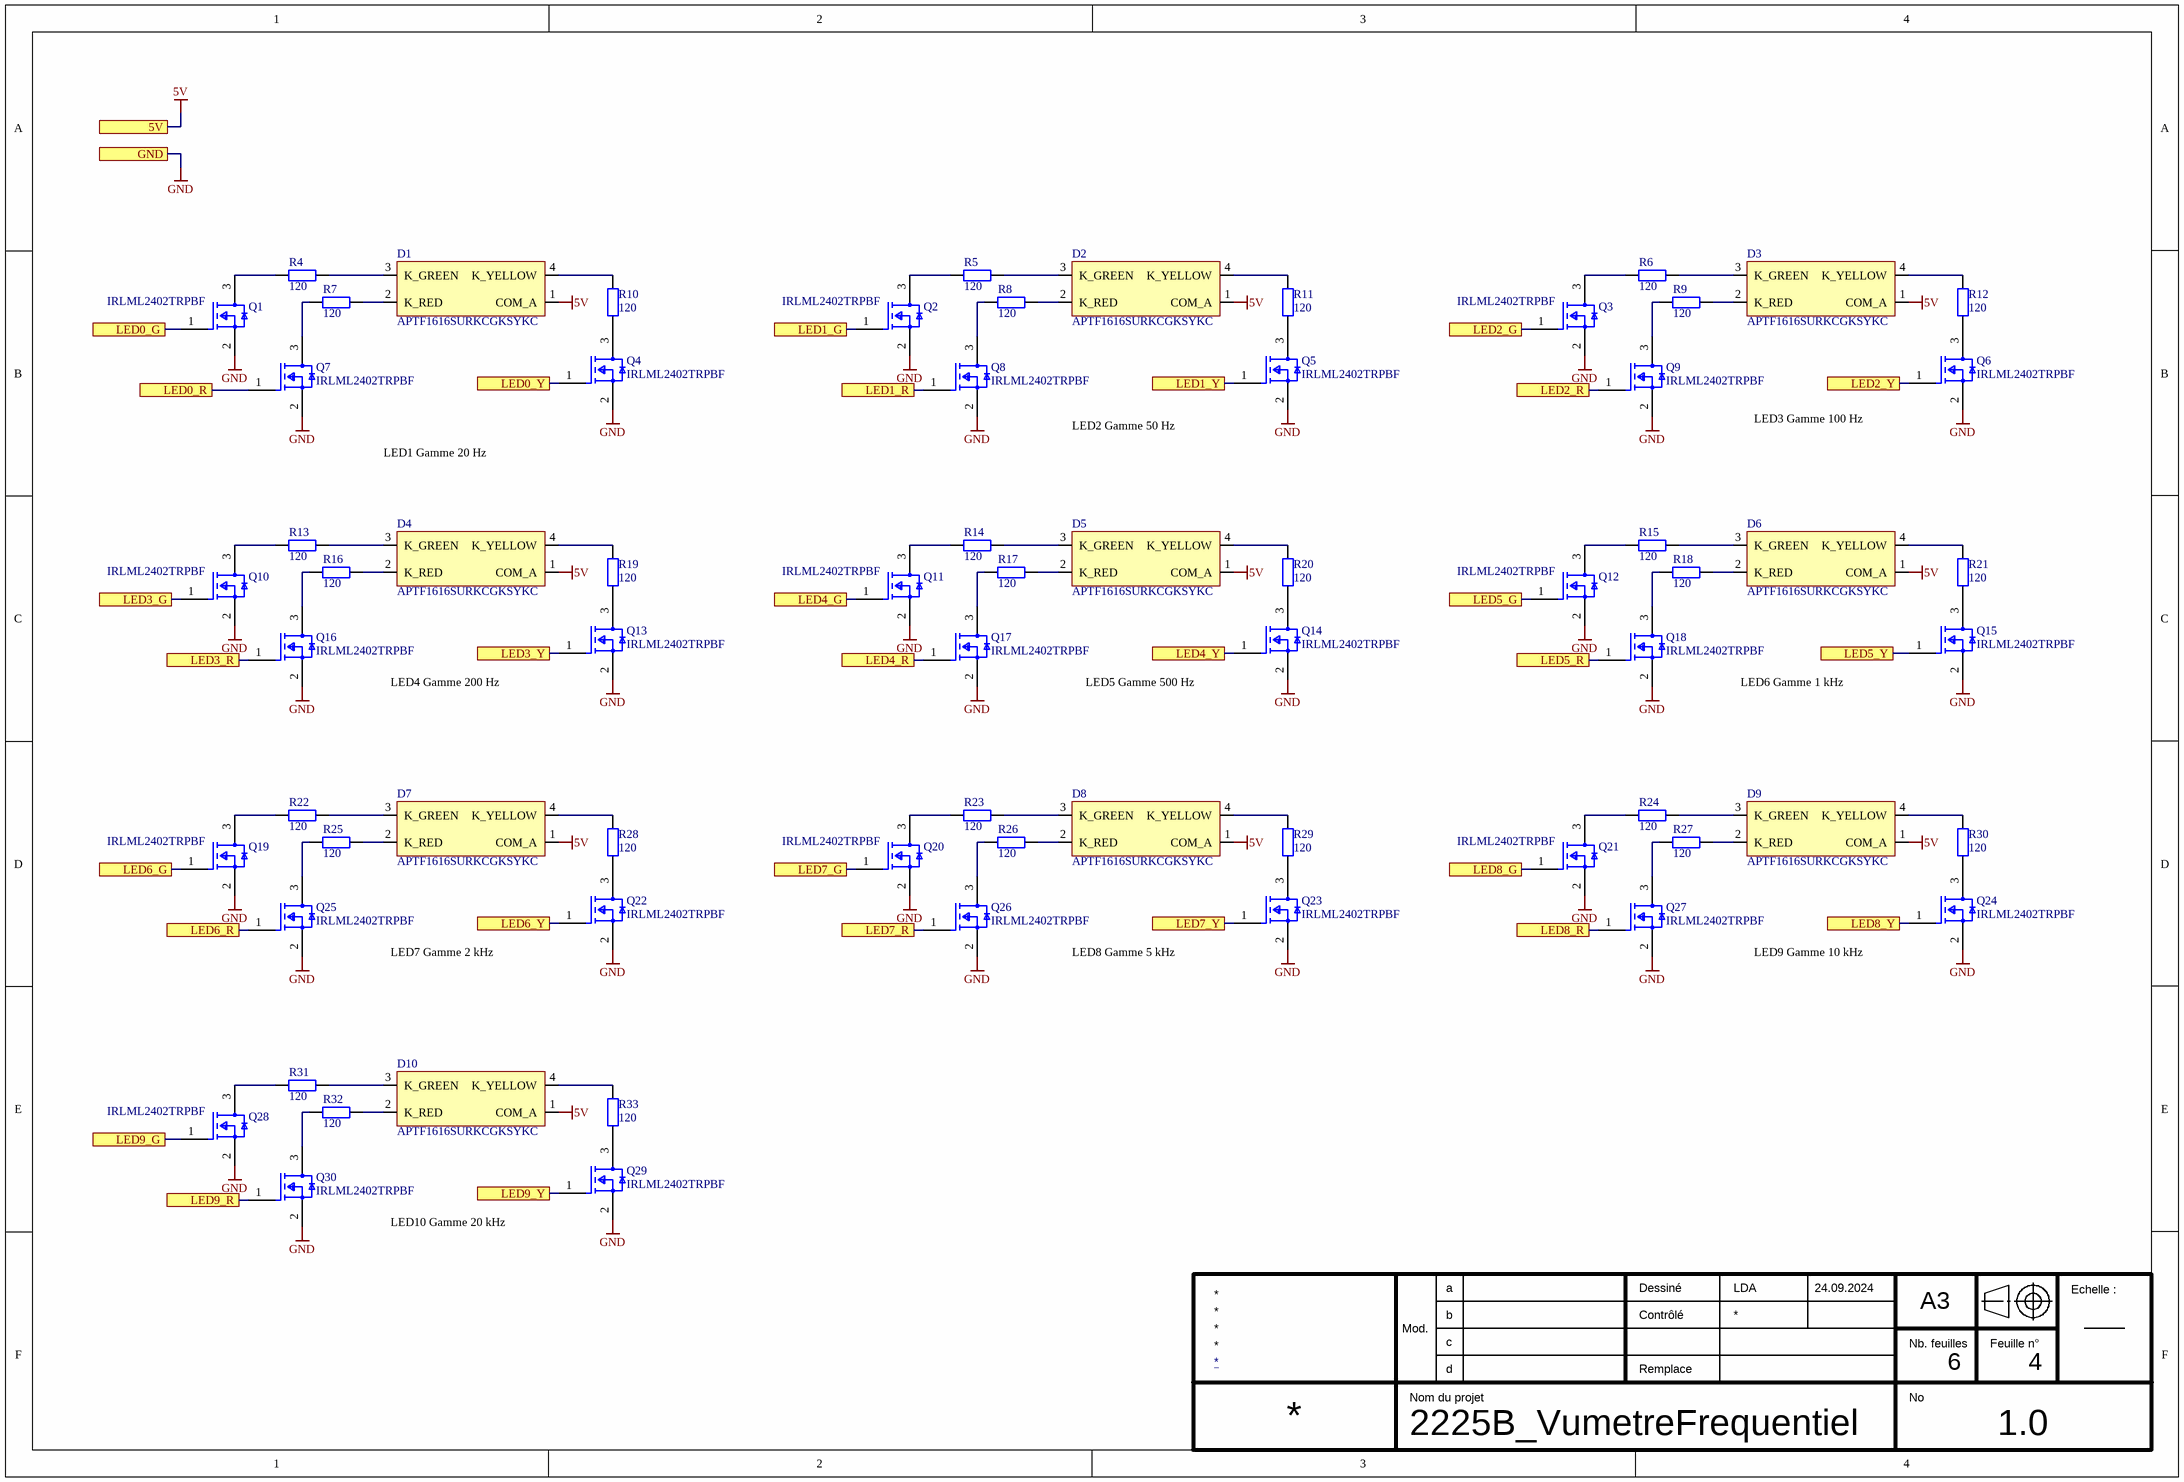
[diagram p4: RGB_LEDs.SchDoc]

### Parts
D1  APTF1616SURKCGKSYKC  [APTF1616SURKCGKSYKC]
D2  APTF1616SURKCGKSYKC  [APTF1616SURKCGKSYKC]
D3  APTF1616SURKCGKSYKC  [APTF1616SURKCGKSYKC]
D4  APTF1616SURKCGKSYKC  [APTF1616SURKCGKSYKC]
D5  APTF1616SURKCGKSYKC  [APTF1616SURKCGKSYKC]
D6  APTF1616SURKCGKSYKC  [APTF1616SURKCGKSYKC]
D7  APTF1616SURKCGKSYKC  [APTF1616SURKCGKSYKC]
D8  APTF1616SURKCGKSYKC  [APTF1616SURKCGKSYKC]
D9  APTF1616SURKCGKSYKC  [APTF1616SURKCGKSYKC]
D10  APTF1616SURKCGKSYKC  [APTF1616SURKCGKSYKC]
Q1  IRLML2402TRPBF  [FP-Micro3-IPC_B]
Q2  IRLML2402TRPBF  [FP-Micro3-IPC_B]
Q3  IRLML2402TRPBF  [FP-Micro3-IPC_B]
Q4  IRLML2402TRPBF  [FP-Micro3-IPC_B]
Q5  IRLML2402TRPBF  [FP-Micro3-IPC_B]
Q6  IRLML2402TRPBF  [FP-Micro3-IPC_B]
Q7  IRLML2402TRPBF  [FP-Micro3-IPC_B]
Q8  IRLML2402TRPBF  [FP-Micro3-IPC_B]
Q9  IRLML2402TRPBF  [FP-Micro3-IPC_B]
Q10  IRLML2402TRPBF  [FP-Micro3-IPC_B]
Q11  IRLML2402TRPBF  [FP-Micro3-IPC_B]
Q12  IRLML2402TRPBF  [FP-Micro3-IPC_B]
Q13  IRLML2402TRPBF  [FP-Micro3-IPC_B]
Q14  IRLML2402TRPBF  [FP-Micro3-IPC_B]
Q15  IRLML2402TRPBF  [FP-Micro3-IPC_B]
Q16  IRLML2402TRPBF  [FP-Micro3-IPC_B]
Q17  IRLML2402TRPBF  [FP-Micro3-IPC_B]
Q18  IRLML2402TRPBF  [FP-Micro3-IPC_B]
Q19  IRLML2402TRPBF  [FP-Micro3-IPC_B]
Q20  IRLML2402TRPBF  [FP-Micro3-IPC_B]
Q21  IRLML2402TRPBF  [FP-Micro3-IPC_B]
Q22  IRLML2402TRPBF  [FP-Micro3-IPC_B]
Q23  IRLML2402TRPBF  [FP-Micro3-IPC_B]
Q24  IRLML2402TRPBF  [FP-Micro3-IPC_B]
Q25  IRLML2402TRPBF  [FP-Micro3-IPC_B]
Q26  IRLML2402TRPBF  [FP-Micro3-IPC_B]
Q27  IRLML2402TRPBF  [FP-Micro3-IPC_B]
Q28  IRLML2402TRPBF  [FP-Micro3-IPC_B]
Q29  IRLML2402TRPBF  [FP-Micro3-IPC_B]
Q30  IRLML2402TRPBF  [FP-Micro3-IPC_B]
R4  120  [RESC2012X06M]
R5  120  [RESC2012X06M]
R6  120  [RESC2012X06M]
R7  120  [RESC2012X06M]
R8  120  [RESC2012X06M]
R9  120  [RESC2012X06M]
R10  120  [RESC2012X06M]
R11  120  [RESC2012X06M]
R12  120  [RESC2012X06M]
R13  120  [RESC2012X06M]
R14  120  [RESC2012X06M]
R15  120  [RESC2012X06M]
R16  120  [RESC2012X06M]
R17  120  [RESC2012X06M]
R18  120  [RESC2012X06M]
R19  120  [RESC2012X06M]
R20  120  [RESC2012X06M]
R21  120  [RESC2012X06M]
R22  120  [RESC2012X06M]
R23  120  [RESC2012X06M]
R24  120  [RESC2012X06M]
R25  120  [RESC2012X06M]
R26  120  [RESC2012X06M]
R27  120  [RESC2012X06M]
R28  120  [RESC2012X06M]
R29  120  [RESC2012X06M]
R30  120  [RESC2012X06M]
R31  120  [RESC2012X06M]
R32  120  [RESC2012X06M]
R33  120  [RESC2012X06M]

### Ports
5V, GND, LED0_G, LED0_R, LED0_Y, LED1_G, LED1_R, LED1_Y, LED2_G, LED2_R, LED2_Y, LED3_G, LED3_R, LED3_Y, LED4_G, LED4_R, LED4_Y, LED5_G, LED5_R, LED5_Y, LED6_G, LED6_R, LED6_Y, LED7_G, LED7_R, LED7_Y, LED8_G, LED8_R, LED8_Y, LED9_G, LED9_R, LED9_Y

### Nets
5V: D1.1(COM_A) D2.1(COM_A) D3.1(COM_A) D4.1(COM_A) D5.1(COM_A) D6.1(COM_A) D7.1(COM_A) D8.1(COM_A) D9.1(COM_A) D10.1(COM_A) ; port 5V
GND: Q1.2(S) Q2.2(S) Q3.2(S) Q4.2(S) Q5.2(S) Q6.2(S) Q7.2(S) Q8.2(S) Q9.2(S) Q10.2(S) Q11.2(S) Q12.2(S) Q13.2(S) Q14.2(S) Q15.2(S) Q16.2(S) Q17.2(S) Q18.2(S) Q19.2(S) Q20.2(S) Q21.2(S) Q22.2(S) Q23.2(S) Q24.2(S) Q25.2(S) Q26.2(S) Q27.2(S) Q28.2(S) Q29.2(S) Q30.2(S) ; port GND
LED0_G: Q1.1(G) ; port LED0_G
LED0_R: Q7.1(G) ; port LED0_R
LED0_Y: Q4.1(G) ; port LED0_Y
LED1_G: Q2.1(G) ; port LED1_G
LED1_R: Q8.1(G) ; port LED1_R
LED1_Y: Q5.1(G) ; port LED1_Y
LED2_G: Q3.1(G) ; port LED2_G
LED2_R: Q9.1(G) ; port LED2_R
LED2_Y: Q6.1(G) ; port LED2_Y
LED3_G: Q10.1(G) ; port LED3_G
LED3_R: Q16.1(G) ; port LED3_R
LED3_Y: Q13.1(G) ; port LED3_Y
LED4_G: Q11.1(G) ; port LED4_G
LED4_R: Q17.1(G) ; port LED4_R
LED4_Y: Q14.1(G) ; port LED4_Y
LED5_G: Q12.1(G) ; port LED5_G
LED5_R: Q18.1(G) ; port LED5_R
LED5_Y: Q15.1(G) ; port LED5_Y
LED6_G: Q19.1(G) ; port LED6_G
LED6_R: Q25.1(G) ; port LED6_R
LED6_Y: Q22.1(G) ; port LED6_Y
LED7_G: Q20.1(G) ; port LED7_G
LED7_R: Q26.1(G) ; port LED7_R
LED7_Y: Q23.1(G) ; port LED7_Y
LED8_G: Q21.1(G) ; port LED8_G
LED8_R: Q27.1(G) ; port LED8_R
LED8_Y: Q24.1(G) ; port LED8_Y
LED9_G: Q28.1(G) ; port LED9_G
LED9_R: Q30.1(G) ; port LED9_R
LED9_Y: Q29.1(G) ; port LED9_Y
NetD1_2: D1.2(K_RED) R7.1
NetD1_3: D1.3(K_GREEN) R4.1
NetD1_4: D1.4(K_YELLOW) R10.1
NetD2_2: D2.2(K_RED) R8.1
NetD2_3: D2.3(K_GREEN) R5.1
NetD2_4: D2.4(K_YELLOW) R11.1
NetD3_2: D3.2(K_RED) R9.1
NetD3_3: D3.3(K_GREEN) R6.1
NetD3_4: D3.4(K_YELLOW) R12.1
NetD4_2: D4.2(K_RED) R16.1
NetD4_3: D4.3(K_GREEN) R13.1
NetD4_4: D4.4(K_YELLOW) R19.1
NetD5_2: D5.2(K_RED) R17.1
NetD5_3: D5.3(K_GREEN) R14.1
NetD5_4: D5.4(K_YELLOW) R20.1
NetD6_2: D6.2(K_RED) R18.1
NetD6_3: D6.3(K_GREEN) R15.1
NetD6_4: D6.4(K_YELLOW) R21.1
NetD7_2: D7.2(K_RED) R25.1
NetD7_3: D7.3(K_GREEN) R22.1
NetD7_4: D7.4(K_YELLOW) R28.1
NetD8_2: D8.2(K_RED) R26.1
NetD8_3: D8.3(K_GREEN) R23.1
NetD8_4: D8.4(K_YELLOW) R29.1
NetD9_2: D9.2(K_RED) R27.1
NetD9_3: D9.3(K_GREEN) R24.1
NetD9_4: D9.4(K_YELLOW) R30.1
NetD10_2: D10.2(K_RED) R32.1
NetD10_3: D10.3(K_GREEN) R31.1
NetD10_4: D10.4(K_YELLOW) R33.1
NetQ1_3: Q1.3(D) R4.2
NetQ2_3: Q2.3(D) R5.2
NetQ3_3: Q3.3(D) R6.2
NetQ4_3: Q4.3(D) R10.2
NetQ5_3: Q5.3(D) R11.2
NetQ6_3: Q6.3(D) R12.2
NetQ7_3: Q7.3(D) R7.2
NetQ8_3: Q8.3(D) R8.2
NetQ9_3: Q9.3(D) R9.2
NetQ10_3: Q10.3(D) R13.2
NetQ11_3: Q11.3(D) R14.2
NetQ12_3: Q12.3(D) R15.2
NetQ13_3: Q13.3(D) R19.2
NetQ14_3: Q14.3(D) R20.2
NetQ15_3: Q15.3(D) R21.2
NetQ16_3: Q16.3(D) R16.2
NetQ17_3: Q17.3(D) R17.2
NetQ18_3: Q18.3(D) R18.2
NetQ19_3: Q19.3(D) R22.2
NetQ20_3: Q20.3(D) R23.2
NetQ21_3: Q21.3(D) R24.2
NetQ22_3: Q22.3(D) R28.2
NetQ23_3: Q23.3(D) R29.2
NetQ24_3: Q24.3(D) R30.2
NetQ25_3: Q25.3(D) R25.2
NetQ26_3: Q26.3(D) R26.2
NetQ27_3: Q27.3(D) R27.2
NetQ28_3: Q28.3(D) R31.2
NetQ29_3: Q29.3(D) R33.2
NetQ30_3: Q30.3(D) R32.2

### Notes on the sheet
- LED1 Gamme 20 Hz
- LED2 Gamme 50 Hz
- LED3 Gamme 100 Hz
- LED4 Gamme 200 Hz
- LED5 Gamme 500 Hz
- LED6 Gamme 1 kHz
- LED7 Gamme 2 kHz
- LED8 Gamme 5 kHz
- LED9 Gamme 10 kHz
- LED10 Gamme 20 kHz
- a
- Dessiné
- A3
- Echelle :
- Mod.
- b
- c
- d
- Contrôlé
- Remplace
- Nb. feuilles
- Feuille n°
- Nom du projet
- No

### Library data of the parts
D1-D10 = APTF1616SURKCGKSYKC: Green, Red, Yellow 570nm Green, 630nm Red, 590nm Yellow LED Indication - Discrete 2.1V Green, 1.95V Red, 2V Yellow 4-SMD, No Lead; Manufacturer_Name: Kingbright; Geometry.Height: 0.9mm; Manufacturer_Part_Number: APTF1616SURKCGKSYKC; Mouser Part Number: 604-APTF1616KCGKSYKC; Mouser Price/Stock: https://www.mouser.co.uk/ProductDetail/Kingbright/APTF1616SURKCGKSYKC?qs=FESYatJ8odK7UleJtP4p0g%3D%3D; Arrow Part Number: APTF1616SURKCGKSYKC; Arrow Price/Stock: https://www.arrow.com/en/products/aptf1616surkcgksykc/kingbright?region=nac; Datasheet Link: https://www.kingbrightusa.com/images/catalog/SPEC/APTF1616SURKCGKSYKC.pdf
Q1-Q30 = CMP-32901-000179-1: MOSFET N-CH 20V 1.2A SOT-23; Max Power Dissipation: 540mW; Gate to Source Voltage (Vgs): 12V; Drain to Source Resistance: 350mR; Rise Time: 9.5ns; Threshold Voltage: 700mV; Turn-On Delay Time: 2.5ns; Input Capacitance: 110pF; Element Configuration: Single; Power Dissipation: 540W; Turn-Off Delay Time: 9.7ns; Rds On Max: 250mR; REACH SVHC: No SVHC; Mount: Surface Mount; Packaging: Tape and Reel; Height: 0.04inch; Drain to Source Voltage (Vdss): 20V; Length: 0.119inch; Contact Plating: Tin; Continuous Drain Current (ID): 1.2A; Lead Free: Lead Free; Drain to Source Breakdown Voltage: 20V; Max Dual Supply Voltage: 20V; Number of Pins: 3; Halogen Free: Halogen Free; Max Operating Temperature: 150°C; Case/Package: SOT-23; Min Operating Temperature: -55°C; Width: 0.055inch
R4-R33 = Res2: Resistor; Published: 8-Jun-2000; LatestRevisionDate: 17-Jul-2002; LatestRevisionNote: Re-released for DXP Platform.; PackageReference: AXIAL-0.4; Publisher: Altium Limited; PackageDescription: Axial Device, Thru-Hole; 2 Leads; 0.4 in Pin Spacing; Value: 120

## Sheet DAC.SchDoc: 2225B_VumetreFrequentiel
size 276 x 198 mm; Date: 24.09.2024; DrawnBy: LDA; DocumentNumber: 1.0; SheetNumber: 6; SheetTotal: 6
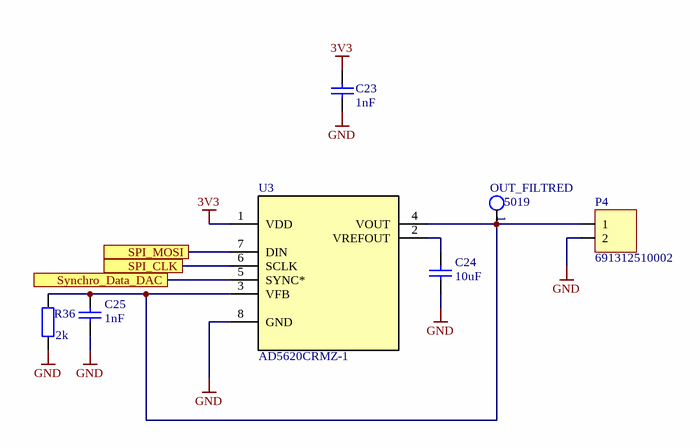
[diagram p5: DAC.SchDoc]

### Parts
C23  1nF  [C0805]
C24  10uF  [C0805]
C25  1nF  [C0805]
OUT_FILTRED  5019  [KEYSTONE_5019]
P4  691312510002  [LINX_CONBNC002]
R36  2k  [RESC2012X06M]
U3  AD5620CRMZ-1  [SOP65P490X110-8N]

### Ports
SPI_CLK, SPI_MOSI, Synchro_Data_DAC

### Nets
3V3: C23.2 U3.1(VDD)
GND: C23.1 C24.1 C25.1 P4.2 R36.1 U3.8(GND)
SPI_CLK: U3.6(SCLK) ; port SPI_CLK
SPI_MOSI: U3.7(DIN) ; port SPI_MOSI
Synchro_Data_DAC: U3.5(SYNC*) ; port Synchro_Data_DAC
NetC24_2: C24.2 U3.2(VREFOUT)
NetC25_2: C25.2 OUT_FILTRED.1 P4.1 R36.2 U3.3(VFB) U3.4(VOUT)

### Notes on the sheet
- a
- Dessiné
- A4
- Echelle :
- Mod.
- b
- c
- d
- Contrôlé
- Remplace
- Nb. feuilles
- Feuille n°
- Nom du projet
- No

### Library data of the parts
C23-C25 = Cap: Capacitor; Published: 8-Jun-2000; LatestRevisionDate: 17-Jul-2002; LatestRevisionNote: Re-released for DXP Platform.; PackageReference: RAD-0.3; Publisher: Altium Limited; PackageDescription: Radial Cap, Thru-Hole; 2 Leads; 0.3 in Pin Spacing
  C23 C25: Value: 1nF
  C24: Value: 10uF
OUT_FILTRED = CMP-1672-00008-2: as AUDIO_IN on sheet 2225B_VumetreFrequenciel; Contact Material: Bronze, Silver; Number of Pins: 1; Lead Free: Lead Free; Packaging: Tape and Reel; Mount: Surface Mount; Height: 2.286mm; Contact Plating: Silver; Material: Bronze; Termination: SMD/SMT; REACH SVHC: No SVHC; RoHS: Compliant; Manufacturer Part Number: 5019
P4 = MHDR1X2: Header, 2-Pin; LatestRevisionDate: 17-Jul-2002; LatestRevisionNote: Re-released for DXP Platform.; Publisher: Altium Limited
R36 = Res2: Resistor; Published: 8-Jun-2000; LatestRevisionDate: 17-Jul-2002; LatestRevisionNote: Re-released for DXP Platform.; PackageReference: AXIAL-0.4; Publisher: Altium Limited; PackageDescription: Axial Device, Thru-Hole; 2 Leads; 0.4 in Pin Spacing; Value: 2k
U3 = AD5620CRMZ-1: Single, 12-Bit nanoDACÂ® with 5 ppm/Â°C On-Chip Reference in SOT-23; MF: Analog Devices; Value: *; Price: None; Package: MSOP-8 Analog Devices; MP: AD5620CRMZ-1; Purchase-URL: https://pricing.snapeda.com/search/part/AD5620CRMZ-1/?ref=eda; SnapEDA_Link: https://www.snapeda.com/parts/AD5620CRMZ-1/Analog+Devices/view-part/?ref=snap; Check_prices: https://www.snapeda.com/parts/AD5620CRMZ-1/Analog+Devices/view-part/?ref=eda; Availability: In Stock

## Nets that join several sheets
3V3: alimentation (C5.2 TP8.1 U1.3), MCU (17 pins), DAC (C23.2 U3.1)
5V: 2225B_VumetreFrequenciel (X1.3 X1.7), alimentation (8 pins), Com_PC (C10.1 FB1.2 R3.1), RGB_LEDs (10 pins)
GND: 2225B_VumetreFrequenciel (7 pins), alimentation (20 pins), Com_PC (11 pins), MCU (20 pins), RGB_LEDs (30 pins), DAC (6 pins)
DIN: 2225B_VumetreFrequenciel (DIN.1 X1.1), MCU (U2.11)
LED0_G: 2225B_VumetreFrequenciel (LED0_G.1), MCU (U2.47), RGB_LEDs (Q1.1)
LED0_R: 2225B_VumetreFrequenciel (LED0_R.1), MCU (U2.46), RGB_LEDs (Q7.1)
LED0_Y: 2225B_VumetreFrequenciel (LED0_Y.1), MCU (U2.48), RGB_LEDs (Q4.1)
LED1_G: MCU (U2.44), RGB_LEDs (Q2.1)
LED1_R: MCU (U2.43), RGB_LEDs (Q8.1)
LED1_Y: MCU (U2.45), RGB_LEDs (Q5.1)
LED2_G: MCU (U2.41), RGB_LEDs (Q3.1)
LED2_R: MCU (U2.38), RGB_LEDs (Q9.1)
LED2_Y: MCU (U2.42), RGB_LEDs (Q6.1)
LED3_G: MCU (U2.51), RGB_LEDs (Q10.1)
LED3_R: MCU (U2.52), RGB_LEDs (Q16.1)
LED3_Y: MCU (U2.50), RGB_LEDs (Q13.1)
LED4_G: MCU (U2.56), RGB_LEDs (Q11.1)
LED4_R: MCU (U2.30), RGB_LEDs (Q17.1)
LED4_Y: MCU (U2.53), RGB_LEDs (Q14.1)
LED5_G: MCU (U2.28), RGB_LEDs (Q12.1)
LED5_R: MCU (U2.27), RGB_LEDs (Q18.1)
LED5_Y: MCU (U2.29), RGB_LEDs (Q15.1)
LED6_G: MCU (U2.23), RGB_LEDs (Q19.1)
LED6_R: MCU (U2.22), RGB_LEDs (Q25.1)
LED6_Y: MCU (U2.24), RGB_LEDs (Q22.1)
LED7_G: MCU (U2.58), RGB_LEDs (Q20.1)
LED7_R: MCU (U2.61), RGB_LEDs (Q26.1)
LED7_Y: MCU (U2.57), RGB_LEDs (Q23.1)
LED8_G: MCU (U2.63), RGB_LEDs (Q21.1)
LED8_R: MCU (U2.64), RGB_LEDs (Q27.1)
LED8_Y: MCU (U2.62), RGB_LEDs (Q24.1)
LED9_G: MCU (U2.3), RGB_LEDs (Q28.1)
LED9_R: MCU (U2.2), RGB_LEDs (Q30.1)
LED9_Y: MCU (U2.12), RGB_LEDs (Q29.1)
NetAUDIO_IN_1: 2225B_VumetreFrequenciel (AUDIO_IN.1 C2.1 L1.2), MCU (U2.14)
NetB1_1: 2225B_VumetreFrequenciel (FTDI_RXD.1), Com_PC (B1.1), MCU (U2.6)
NetB1_3: 2225B_VumetreFrequenciel (FTDI_CTS.1), Com_PC (B1.3), MCU (U2.21)
NetB1_5: 2225B_VumetreFrequenciel (FTDI_TXD.1), Com_PC (B1.5), MCU (U2.13)
NetB1_11: 2225B_VumetreFrequenciel (FTDI_RST.1), Com_PC (B1.11), MCU (U2.17)
SPI2_MISO: 2225B_VumetreFrequenciel (SPI2_MISO.1 X1.2), MCU (U2.5)
SPI2_SCK: 2225B_VumetreFrequenciel (SPI2_SCK.1 X1.6), MCU (U2.4)
SPI2_SS1: 2225B_VumetreFrequenciel (SPI2_SS.1 X1.5), MCU (U2.10)
SPI_CLK: 2225B_VumetreFrequenciel (SPI1_CLK.1), MCU (U2.49), DAC (U3.6)
SPI_MOSI: 2225B_VumetreFrequenciel (SPI1_MOSI.1), MCU (U2.1), DAC (U3.7)
Synchro_Data_DAC: 2225B_VumetreFrequenciel (Synchro_Data_DAC.1), MCU (U2.18), DAC (U3.5)
USB1_N: 2225B_VumetreFrequenciel (USB1_N.1), alimentation (J24.A7), Com_PC (B1.16 C9.1)
USB1_P: 2225B_VumetreFrequenciel (USB1_P.1), alimentation (J24.A6), Com_PC (B1.15 C8.1)
USB2_N: 2225B_VumetreFrequenciel (USB2_N.1), alimentation (J24.B7), MCU (U2.36)
USB2_P: 2225B_VumetreFrequenciel (USB2_P.1), alimentation (J24.B6), MCU (U2.37)